# Altium schematic sheet mach_plc.SchDoc
size A2; SheetNumber: 1; SheetTotal: 1
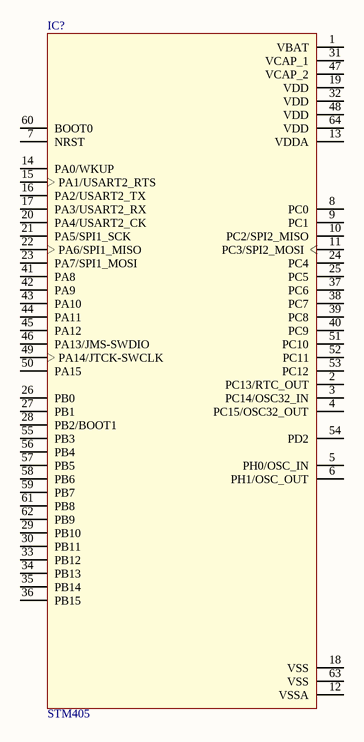
[diagram p0: mach_plc.SchDoc]

## Parts
IC?  STM405  [STM405]

## Nets

Not connected (* = marked no-connect by the designer): IC? 1(VBAT) 2(PC13/RTC_OUT) 3(PC14/OSC32_IN) 4(PC15/OSC32_OUT) 5(PH0/OSC_IN) 6(PH1/OSC_OUT) 7(NRST) 8(PC0) 9(PC1) 10(PC2/SPI2_MISO) 11(PC3/SPI2_MOSI) 12(VSSA) 13(VDDA) 14(PA0/WKUP) 15(PA1/USART2_RTS) 16(PA2/USART2_TX) 17(PA3/USART2_RX) 18(VSS) 19(VDD) 20(PA4/USART2_CK) 21(PA5/SPI1_SCK) 22(PA6/SPI1_MISO) 23(PA7/SPI1_MOSI) 24(PC4) 25(PC5) 26(PB0) 27(PB1) 28(PB2/BOOT1) 29(PB10) 30(PB11) 31(VCAP_1) 32(VDD) 33(PB12) 34(PB13) 35(PB14) 36(PB15) 37(PC6) 38(PC7) 39(PC8) 40(PC9) 41(PA8) 42(PA9) 43(PA10) 44(PA11) 45(PA12) 46(PA13/JMS-SWDIO) 47(VCAP_2) 48(VDD) 49(PA14/JTCK-SWCLK) 50(PA15) 51(PC10) 52(PC11) 53(PC12) 54(PD2) 55(PB3) 56(PB4) 57(PB5) 58(PB6) 59(PB7) 60(BOOT0) 61(PB8) 62(PB9) 63(VSS) 64(VDD)